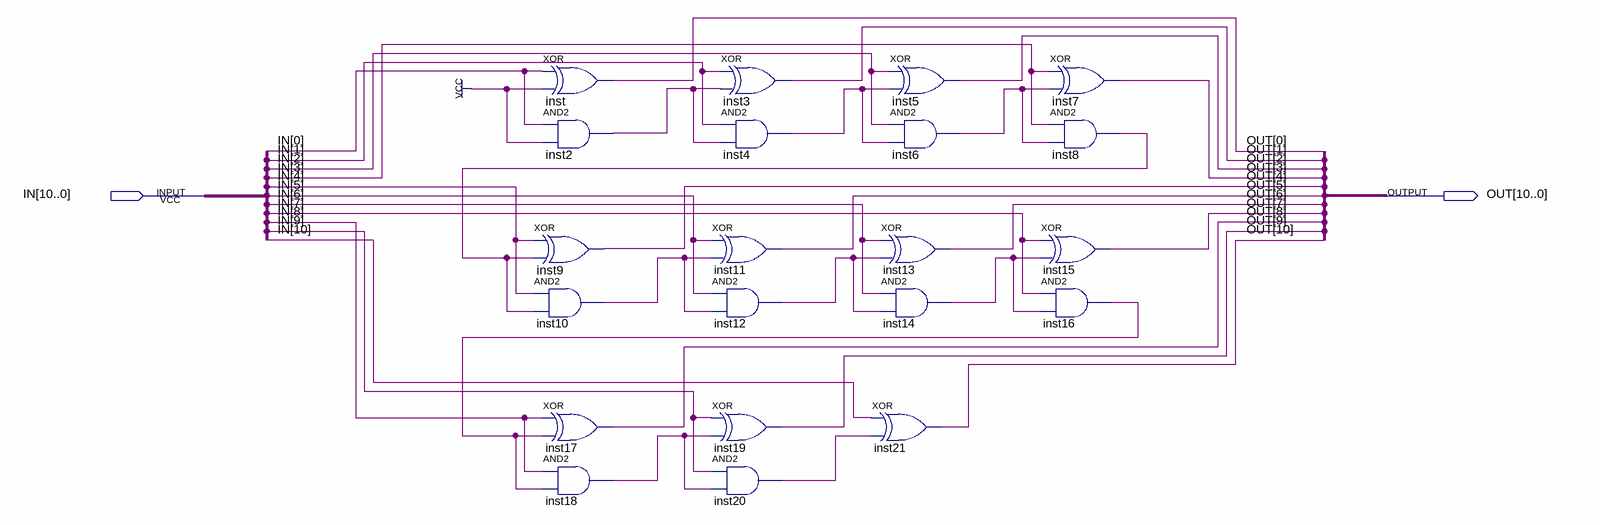
[diagram p0: schematic sheet]
// Quartus schematic INC_11b.bdf as structural Verilog: 21 symbols, 2 pins
module INC_11b (
  input  [10:0] IN,
  output [10:0] OUT
);

  wire inst2_out, inst4_out, inst6_out, inst8_out, inst10_out, inst12_out, inst14_out, inst16_out,
       inst18_out, inst20_out;

  xor inst (OUT[0], IN[0], 1'b1);
  and inst2 (inst2_out, IN[0], 1'b1);
  xor inst9 (OUT[4], IN[4], inst8_out);
  and inst10 (inst10_out, IN[4], inst8_out);
  xor inst17 (OUT[8], IN[8], inst16_out);
  and inst18 (inst18_out, IN[8], inst16_out);
  xor inst3 (OUT[1], IN[1], inst2_out);
  and inst4 (inst4_out, IN[1], inst2_out);
  xor inst11 (OUT[5], IN[5], inst10_out);
  and inst12 (inst12_out, IN[5], inst10_out);
  xor inst19 (OUT[9], IN[9], inst18_out);
  and inst20 (inst20_out, IN[9], inst18_out);
  xor inst5 (OUT[2], IN[2], inst4_out);
  and inst6 (inst6_out, IN[2], inst4_out);
  xor inst13 (OUT[6], IN[6], inst12_out);
  and inst14 (inst14_out, IN[6], inst12_out);
  xor inst21 (OUT[10], IN[10], inst20_out);
  xor inst7 (OUT[3], IN[3], inst6_out);
  and inst8 (inst8_out, IN[3], inst6_out);
  xor inst15 (OUT[7], IN[7], inst14_out);
  and inst16 (inst16_out, IN[7], inst14_out);
endmodule
